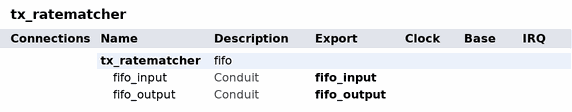
[diagram p0: system contents]
# Platform Designer (Qsys) system tx_ratematcher, Arria 10 10AXF40AA
# Parameters at their usual value, and those the tool derives, are not listed.
package require qsys
create_system tx_ratematcher
set_project_property DEVICE_FAMILY {Arria 10}
set_project_property DEVICE 10AXF40AA

add_instance tx_ratematcher fifo 20.1
set_instance_property tx_ratematcher AUTO_EXPORT true
set_instance_parameter_value tx_ratematcher GUI_AlmostEmpty true
set_instance_parameter_value tx_ratematcher GUI_AlmostEmptyThr 3
set_instance_parameter_value tx_ratematcher GUI_AlmostFull true
set_instance_parameter_value tx_ratematcher GUI_AlmostFullThr 7
set_instance_parameter_value tx_ratematcher GUI_CLOCKS_ARE_SYNCHRONIZED 0
set_instance_parameter_value tx_ratematcher GUI_Clock 0
set_instance_parameter_value tx_ratematcher GUI_DISABLE_DCFIFO_EMBEDDED_TIMING_CONSTRAINT true
set_instance_parameter_value tx_ratematcher GUI_Depth 8
set_instance_parameter_value tx_ratematcher GUI_ENABLE_ECC false
set_instance_parameter_value tx_ratematcher GUI_Empty true
set_instance_parameter_value tx_ratematcher GUI_Full true
set_instance_parameter_value tx_ratematcher GUI_LE_BasedFIFO false
set_instance_parameter_value tx_ratematcher GUI_LegacyRREQ 1
set_instance_parameter_value tx_ratematcher GUI_MAX_DEPTH Auto
set_instance_parameter_value tx_ratematcher GUI_MAX_DEPTH_BY_9 false
set_instance_parameter_value tx_ratematcher GUI_OVERFLOW_CHECKING false
set_instance_parameter_value tx_ratematcher GUI_Optimize 1
set_instance_parameter_value tx_ratematcher GUI_Optimize_max 1
set_instance_parameter_value tx_ratematcher GUI_RAM_BLOCK_TYPE Auto
set_instance_parameter_value tx_ratematcher GUI_UNDERFLOW_CHECKING false
set_instance_parameter_value tx_ratematcher GUI_UsedW true
set_instance_parameter_value tx_ratematcher GUI_Width 256
set_instance_parameter_value tx_ratematcher GUI_dc_aclr true
set_instance_parameter_value tx_ratematcher GUI_delaypipe 5
set_instance_parameter_value tx_ratematcher GUI_diff_widths false
set_instance_parameter_value tx_ratematcher GUI_msb_usedw false
set_instance_parameter_value tx_ratematcher GUI_output_width 640
set_instance_parameter_value tx_ratematcher GUI_read_aclr_synch false
set_instance_parameter_value tx_ratematcher GUI_rsEmpty true
set_instance_parameter_value tx_ratematcher GUI_rsFull true
set_instance_parameter_value tx_ratematcher GUI_rsUsedW true
set_instance_parameter_value tx_ratematcher GUI_sc_aclr false
set_instance_parameter_value tx_ratematcher GUI_sc_sclr true
set_instance_parameter_value tx_ratematcher GUI_synStage 3
set_instance_parameter_value tx_ratematcher GUI_write_aclr_synch true
set_instance_parameter_value tx_ratematcher GUI_wsEmpty false
set_instance_parameter_value tx_ratematcher GUI_wsFull true
set_instance_parameter_value tx_ratematcher GUI_wsUsedW true

# exported interfaces
add_interface fifo_input conduit end
set_interface_property fifo_input EXPORT_OF tx_ratematcher.fifo_input
add_interface fifo_output conduit end
set_interface_property fifo_output EXPORT_OF tx_ratematcher.fifo_output

set_interconnect_requirement {$system} qsys_mm.clockCrossingAdapter HANDSHAKE
set_interconnect_requirement {$system} qsys_mm.insertDefaultSlave FALSE
set_interconnect_requirement {$system} qsys_mm.maxAdditionalLatency 1

save_system tx_ratematcher.qsys
